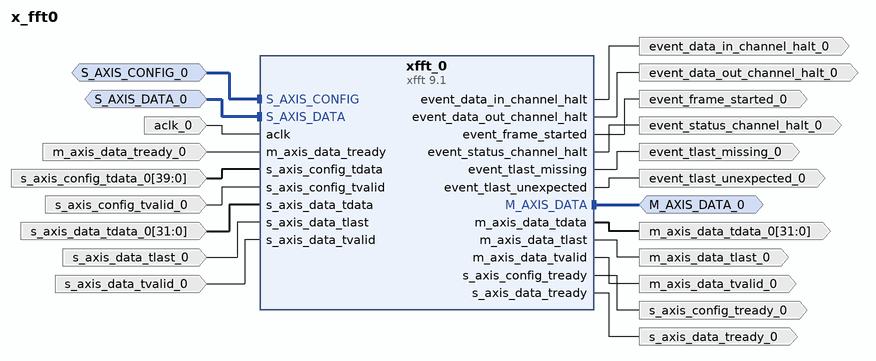
[diagram p0: block diagram of the top level]
# Vivado block design x_fft0, xc7z020clg484-1, Vivado 2023.1
create_bd_design x_fft0

create_bd_intf_port -mode Master -vlnv xilinx.com:interface:axis_rtl:1.0 M_AXIS_DATA_0
create_bd_intf_port -mode Slave -vlnv xilinx.com:interface:axis_rtl:1.0 S_AXIS_CONFIG_0
set_property -dict [list \
  CONFIG.HAS_TKEEP 0 \
  CONFIG.HAS_TLAST 0 \
  CONFIG.HAS_TREADY 1 \
  CONFIG.HAS_TSTRB 0 \
  CONFIG.LAYERED_METADATA undef \
  CONFIG.TDATA_NUM_BYTES 2 \
  CONFIG.TDEST_WIDTH 0 \
  CONFIG.TID_WIDTH 0 \
  CONFIG.TUSER_WIDTH 0 \
] [get_bd_intf_ports S_AXIS_CONFIG_0]
create_bd_intf_port -mode Slave -vlnv xilinx.com:interface:axis_rtl:1.0 S_AXIS_DATA_0
set_property -dict [list \
  CONFIG.HAS_TKEEP 0 \
  CONFIG.HAS_TLAST 1 \
  CONFIG.HAS_TREADY 1 \
  CONFIG.HAS_TSTRB 0 \
  CONFIG.LAYERED_METADATA undef \
  CONFIG.TDATA_NUM_BYTES 4 \
  CONFIG.TDEST_WIDTH 0 \
  CONFIG.TID_WIDTH 0 \
  CONFIG.TUSER_WIDTH 0 \
] [get_bd_intf_ports S_AXIS_DATA_0]
create_bd_port -dir I -type clk aclk_0
create_bd_port -dir O -type intr event_data_in_channel_halt_0
create_bd_port -dir O -type intr event_data_out_channel_halt_0
create_bd_port -dir O -type intr event_frame_started_0
create_bd_port -dir O -type intr event_status_channel_halt_0
create_bd_port -dir O -type intr event_tlast_missing_0
create_bd_port -dir O -type intr event_tlast_unexpected_0
create_bd_port -dir I -from 31 -to 0 s_axis_data_tdata_0
create_bd_port -dir I s_axis_data_tlast_0
create_bd_port -dir O s_axis_data_tready_0
create_bd_port -dir I s_axis_data_tvalid_0
create_bd_port -dir O m_axis_data_tvalid_0
create_bd_port -dir I m_axis_data_tready_0
create_bd_port -dir O m_axis_data_tlast_0
create_bd_port -dir O -from 31 -to 0 m_axis_data_tdata_0
create_bd_port -dir I -from 39 -to 0 s_axis_config_tdata_0
create_bd_port -dir O s_axis_config_tready_0
create_bd_port -dir I s_axis_config_tvalid_0

create_bd_cell -type ip -vlnv xilinx.com:ip:xfft:9.1 xfft_0
set_property -dict [list \
  CONFIG.cyclic_prefix_insertion true \
  CONFIG.implementation_options automatically_select \
  CONFIG.number_of_stages_using_block_ram_for_data_and_phase_factors 3 \
  CONFIG.output_ordering natural_order \
  CONFIG.rounding_modes truncation \
  CONFIG.run_time_configurable_transform_length true \
  CONFIG.target_clock_frequency 100 \
  CONFIG.target_data_throughput 100 \
  CONFIG.xk_index false \
] [get_bd_cells xfft_0]

# ---- connections ----

connect_bd_intf_net -intf_net S_AXIS_CONFIG_0_1 [get_bd_intf_ports S_AXIS_CONFIG_0] [get_bd_intf_pins xfft_0/S_AXIS_CONFIG]
connect_bd_intf_net -intf_net S_AXIS_DATA_0_1 [get_bd_intf_ports S_AXIS_DATA_0] [get_bd_intf_pins xfft_0/S_AXIS_DATA]
connect_bd_intf_net [get_bd_intf_ports M_AXIS_DATA_0] [get_bd_intf_pins xfft_0/M_AXIS_DATA]
connect_bd_net -net aclk_0_1 [get_bd_ports aclk_0] [get_bd_pins xfft_0/aclk]
connect_bd_net -net m_axis_data_tready_0_1 [get_bd_ports m_axis_data_tready_0] [get_bd_pins xfft_0/m_axis_data_tready]
connect_bd_net -net s_axis_config_tdata_0_1 [get_bd_ports s_axis_config_tdata_0] [get_bd_pins xfft_0/s_axis_config_tdata]
connect_bd_net -net s_axis_config_tvalid_0_1 [get_bd_ports s_axis_config_tvalid_0] [get_bd_pins xfft_0/s_axis_config_tvalid]
connect_bd_net -net s_axis_data_tdata_0_1 [get_bd_ports s_axis_data_tdata_0] [get_bd_pins xfft_0/s_axis_data_tdata]
connect_bd_net -net s_axis_data_tlast_0_1 [get_bd_ports s_axis_data_tlast_0] [get_bd_pins xfft_0/s_axis_data_tlast]
connect_bd_net -net s_axis_data_tvalid_0_1 [get_bd_ports s_axis_data_tvalid_0] [get_bd_pins xfft_0/s_axis_data_tvalid]
connect_bd_net [get_bd_pins xfft_0/event_data_in_channel_halt] [get_bd_ports event_data_in_channel_halt_0]
connect_bd_net [get_bd_pins xfft_0/event_data_out_channel_halt] [get_bd_ports event_data_out_channel_halt_0]
connect_bd_net [get_bd_pins xfft_0/event_frame_started] [get_bd_ports event_frame_started_0]
connect_bd_net [get_bd_pins xfft_0/event_status_channel_halt] [get_bd_ports event_status_channel_halt_0]
connect_bd_net [get_bd_pins xfft_0/event_tlast_missing] [get_bd_ports event_tlast_missing_0]
connect_bd_net [get_bd_pins xfft_0/event_tlast_unexpected] [get_bd_ports event_tlast_unexpected_0]
connect_bd_net [get_bd_pins xfft_0/m_axis_data_tdata] [get_bd_ports m_axis_data_tdata_0]
connect_bd_net [get_bd_pins xfft_0/m_axis_data_tlast] [get_bd_ports m_axis_data_tlast_0]
connect_bd_net [get_bd_pins xfft_0/m_axis_data_tvalid] [get_bd_ports m_axis_data_tvalid_0]
connect_bd_net [get_bd_pins xfft_0/s_axis_config_tready] [get_bd_ports s_axis_config_tready_0]
connect_bd_net [get_bd_pins xfft_0/s_axis_data_tready] [get_bd_ports s_axis_data_tready_0]

validate_bd_design
save_bd_design
